# EAGLE design frontend (EAGLE 9.1.1)

## Sheet 1 of 4
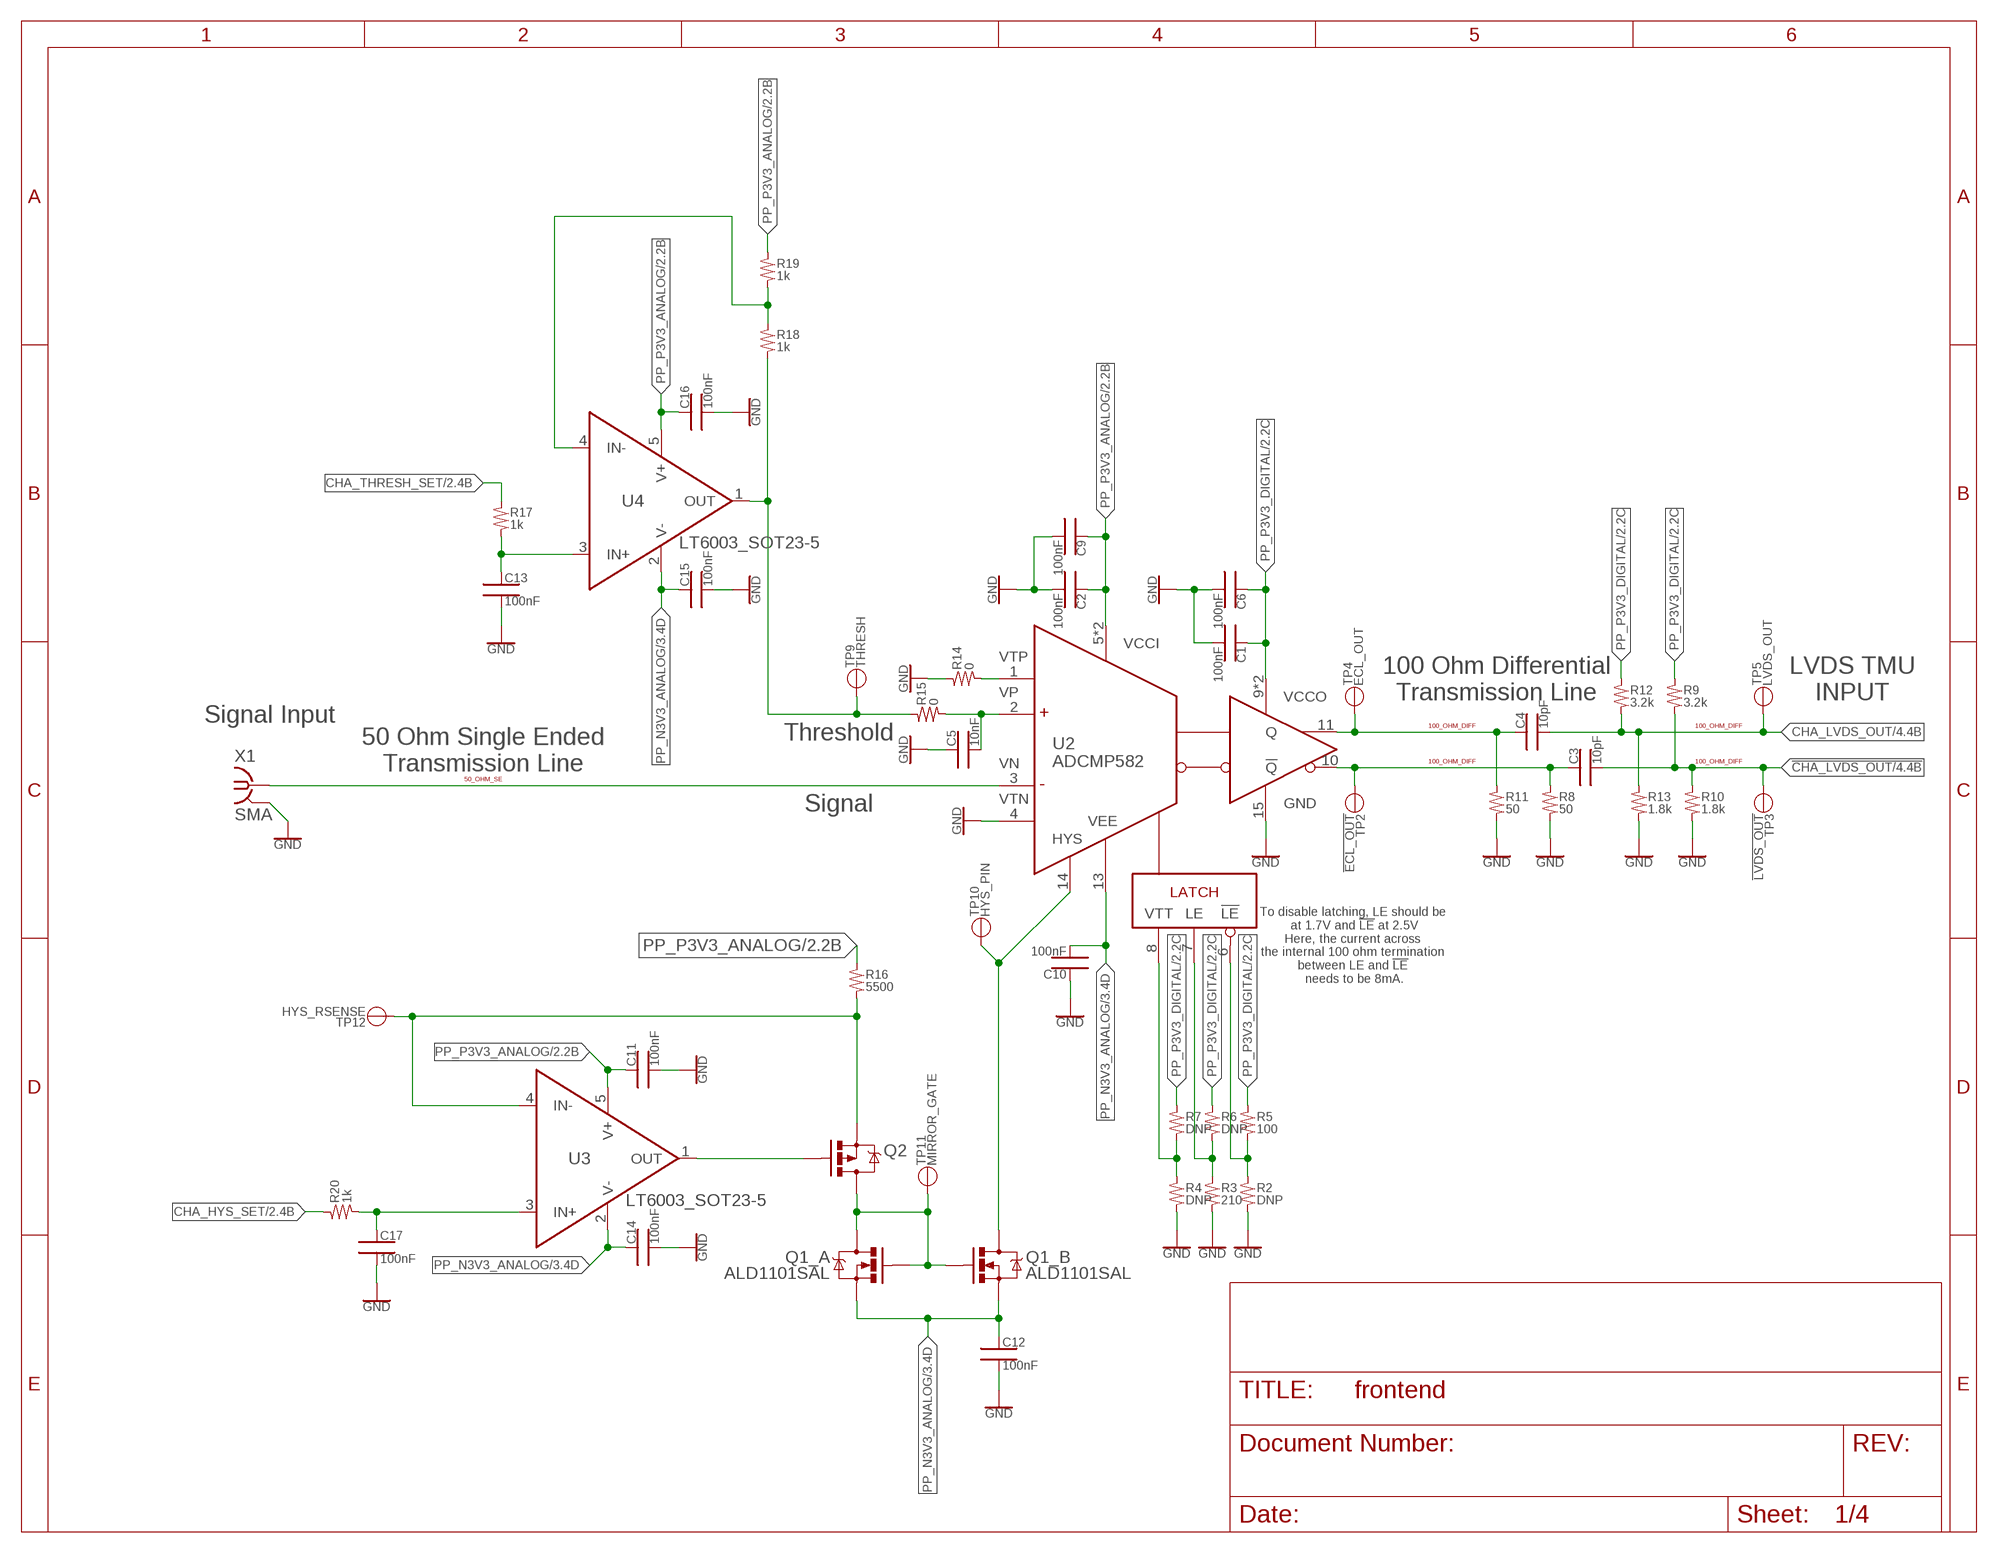
[diagram p0: schematic, sheet 1]

### Parts
C1  100nF  CAP_0402  [0402]
C2  100nF  CAP_0402  [0402]
C3  10pF  CAP_0402  [0402]
C4  10pF  CAP_0402  [0402]
C5  10nF  CAP_0402  [0402]
C6  100nF  CAP_0402  [0402]
C9  100nF  CAP_0402  [0402]
C10  100nF  CAP_0402  [0402]
C11  100nF  CAP_0402  [0402]
C12  100nF  CAP_0402  [0402]
C13  100nF  CAP_0402  [0402]
C14  100nF  CAP_0402  [0402]
C15  100nF  CAP_0402  [0402]
C16  100nF  CAP_0402  [0402]
C17  100nF  CAP_0402  [0402]
Q1  ALD1101SAL  [SOIC_8]
Q2  MOSFET_P-CHANNEL_SOT23-3  [SOT23-3]
R2  DNP  RES_0402  [0402]
R3  210  RES_0402  [0402]
R4  DNP  RES_0402  [0402]
R5  100  RES_0402  [0402]
R6  DNP  RES_0402  [0402]
R7  DNP  RES_0402  [0402]
R8  50  RES_0402  [0402]
R9  3.2k  RES_0402  [0402]
R10  1.8k  RES_0402  [0402]
R11  50  RES_0402  [0402]
R12  3.2k  RES_0402  [0402]
R13  1.8k  RES_0402  [0402]
R14  0  RES_0402  [0402]
R15  0  RES_0402  [0402]
R16  5500  RES_0402  [0402]
R17  1k  RES_0402  [0402]
R18  1k  RES_0402  [0402]
R19  1k  RES_0402  [0402]
R20  1k  RES_0402  [0402]
TP2  !ECL_OUT  TESTPOINT_PAD  [TESTPOINT_PAD]
TP3  !LVDS_OUT  TESTPOINT_PAD  [TESTPOINT_PAD]
TP4  ECL_OUT  TESTPOINT_PAD  [TESTPOINT_PAD]
TP5  LVDS_OUT  TESTPOINT_PAD  [TESTPOINT_PAD]
TP9  THRESH  TESTPOINT_A  [1X01]
TP10  HYS_PIN  TESTPOINT_A  [1X01]
TP11  MIRROR_GATE  TESTPOINT_A  [1X01]
TP12  HYS_RSENSE  TESTPOINT_A  [1X01]
U2  ADCMP582  [QFN50P300X300X80-16N]
U3  LT6003_SOT23-5  [SOT23-5]
U4  LT6003_SOT23-5  [SOT23-5]
X1  SMA  [J502-ND-142-0701-881/886]

### Nets
!CHA_LVDS_OUT [100_OHM_DIFF]: C3.2 R9.2 R10.1 TP3.TP ; also sheet 4
CHA_HYS_SET: R20.1 ; also sheet 2
CHA_LVDS_OUT [100_OHM_DIFF]: C4.2 R12.2 R13.1 TP5.TP ; also sheet 4
CHA_THRESH_SET: R17.1 ; also sheet 2
GND: C1.2 C2.2 C5.1 C6.2 C9.2 C10.1 C11.2 C12.2 C13.2 C14.2 C15.2 C16.2 C17.2 R2.2 R3.2 R4.2 R8.2 R10.2 R11.2 R13.2 R14.1 U2.4(VTN) U2.15(GND) X1.G@1(GND) X1.G@2(GND) X1.G@3(GND) X1.G@4(GND) ; also sheet 2,3,4
N$1: Q2.2(S) R16.2 TP12.1(TP) U3.4(IN-)
N$2: Q1.2(_A:G) Q1.3(_A:D) Q1.6(_B:G) Q2.3(D) TP11.1(TP)
N$3 [100_OHM_DIFF]: C3.1 R8.1 TP2.TP U2.10(!Q)
N$6 [100_OHM_DIFF]: C4.1 R11.1 TP4.TP U2.11(Q)
N$7: R14.2 U2.1(VTP)
N$9: C13.1 R17.2 U4.3(IN+)
N$10: Q2.1(G) U3.1(OUT)
N$12: R18.1 R19.2 U4.4(IN-)
N$13: R15.1 R18.2 TP9.1(TP) U4.1(OUT)
N$17: C17.1 R20.2 U3.3(IN+)
N$18 [50_OHM_SE]: U2.3(VN) X1.1
N$37: C5.2 R15.2 U2.2(VP)
N$38: R4.1 R7.2 U2.8(VTT)
N$39: R3.1 R6.2 U2.7(LE)
N$41: R2.1 R5.2 U2.6(!LE)
N$42: Q1.5(_B:D) TP10.1(TP) U2.14(HYS)
PP_N3V3_ANALOG: C10.2 C12.1 C14.1 C15.1 Q1.1(_A:S) Q1.7(_B:S) Q1.8(_A:S) U2.13(VEE) U3.2(V-) U4.2(V-) ; also sheet 3
PP_P3V3_ANALOG: C2.1 C9.1 C11.1 C16.1 R16.1 R19.1 U2.5(VCCI) U2.16(VCCI) U3.5(V+) U4.5(V+) ; also sheet 2,3
PP_P3V3_DIGITAL: C1.1 C6.1 R5.1 R6.1 R7.1 R9.1 R12.1 U2.9(VCCO) U2.12(VCCO) ; also sheet 2,3,4

### Notes on the sheet
- 100 Ohm Differential
  Transmission Line
- LVDS TMU
  INPUT
- Signal Input
- 100_OHM_DIFF | 100_OHM_DIFF
- Threshold
- 50 Ohm Single Ended
  Transmission Line
- 100_OHM_DIFF | 100_OHM_DIFF
- 50_OHM_SE
- Signal
- To disable latching, LE should be 
  at 1.7V and !LE! at 2.5V
  Here, the current across 
  the internal 100 ohm termination 
  between LE and !LE! 
  needs to be 8mA.

## Sheet 2 of 4
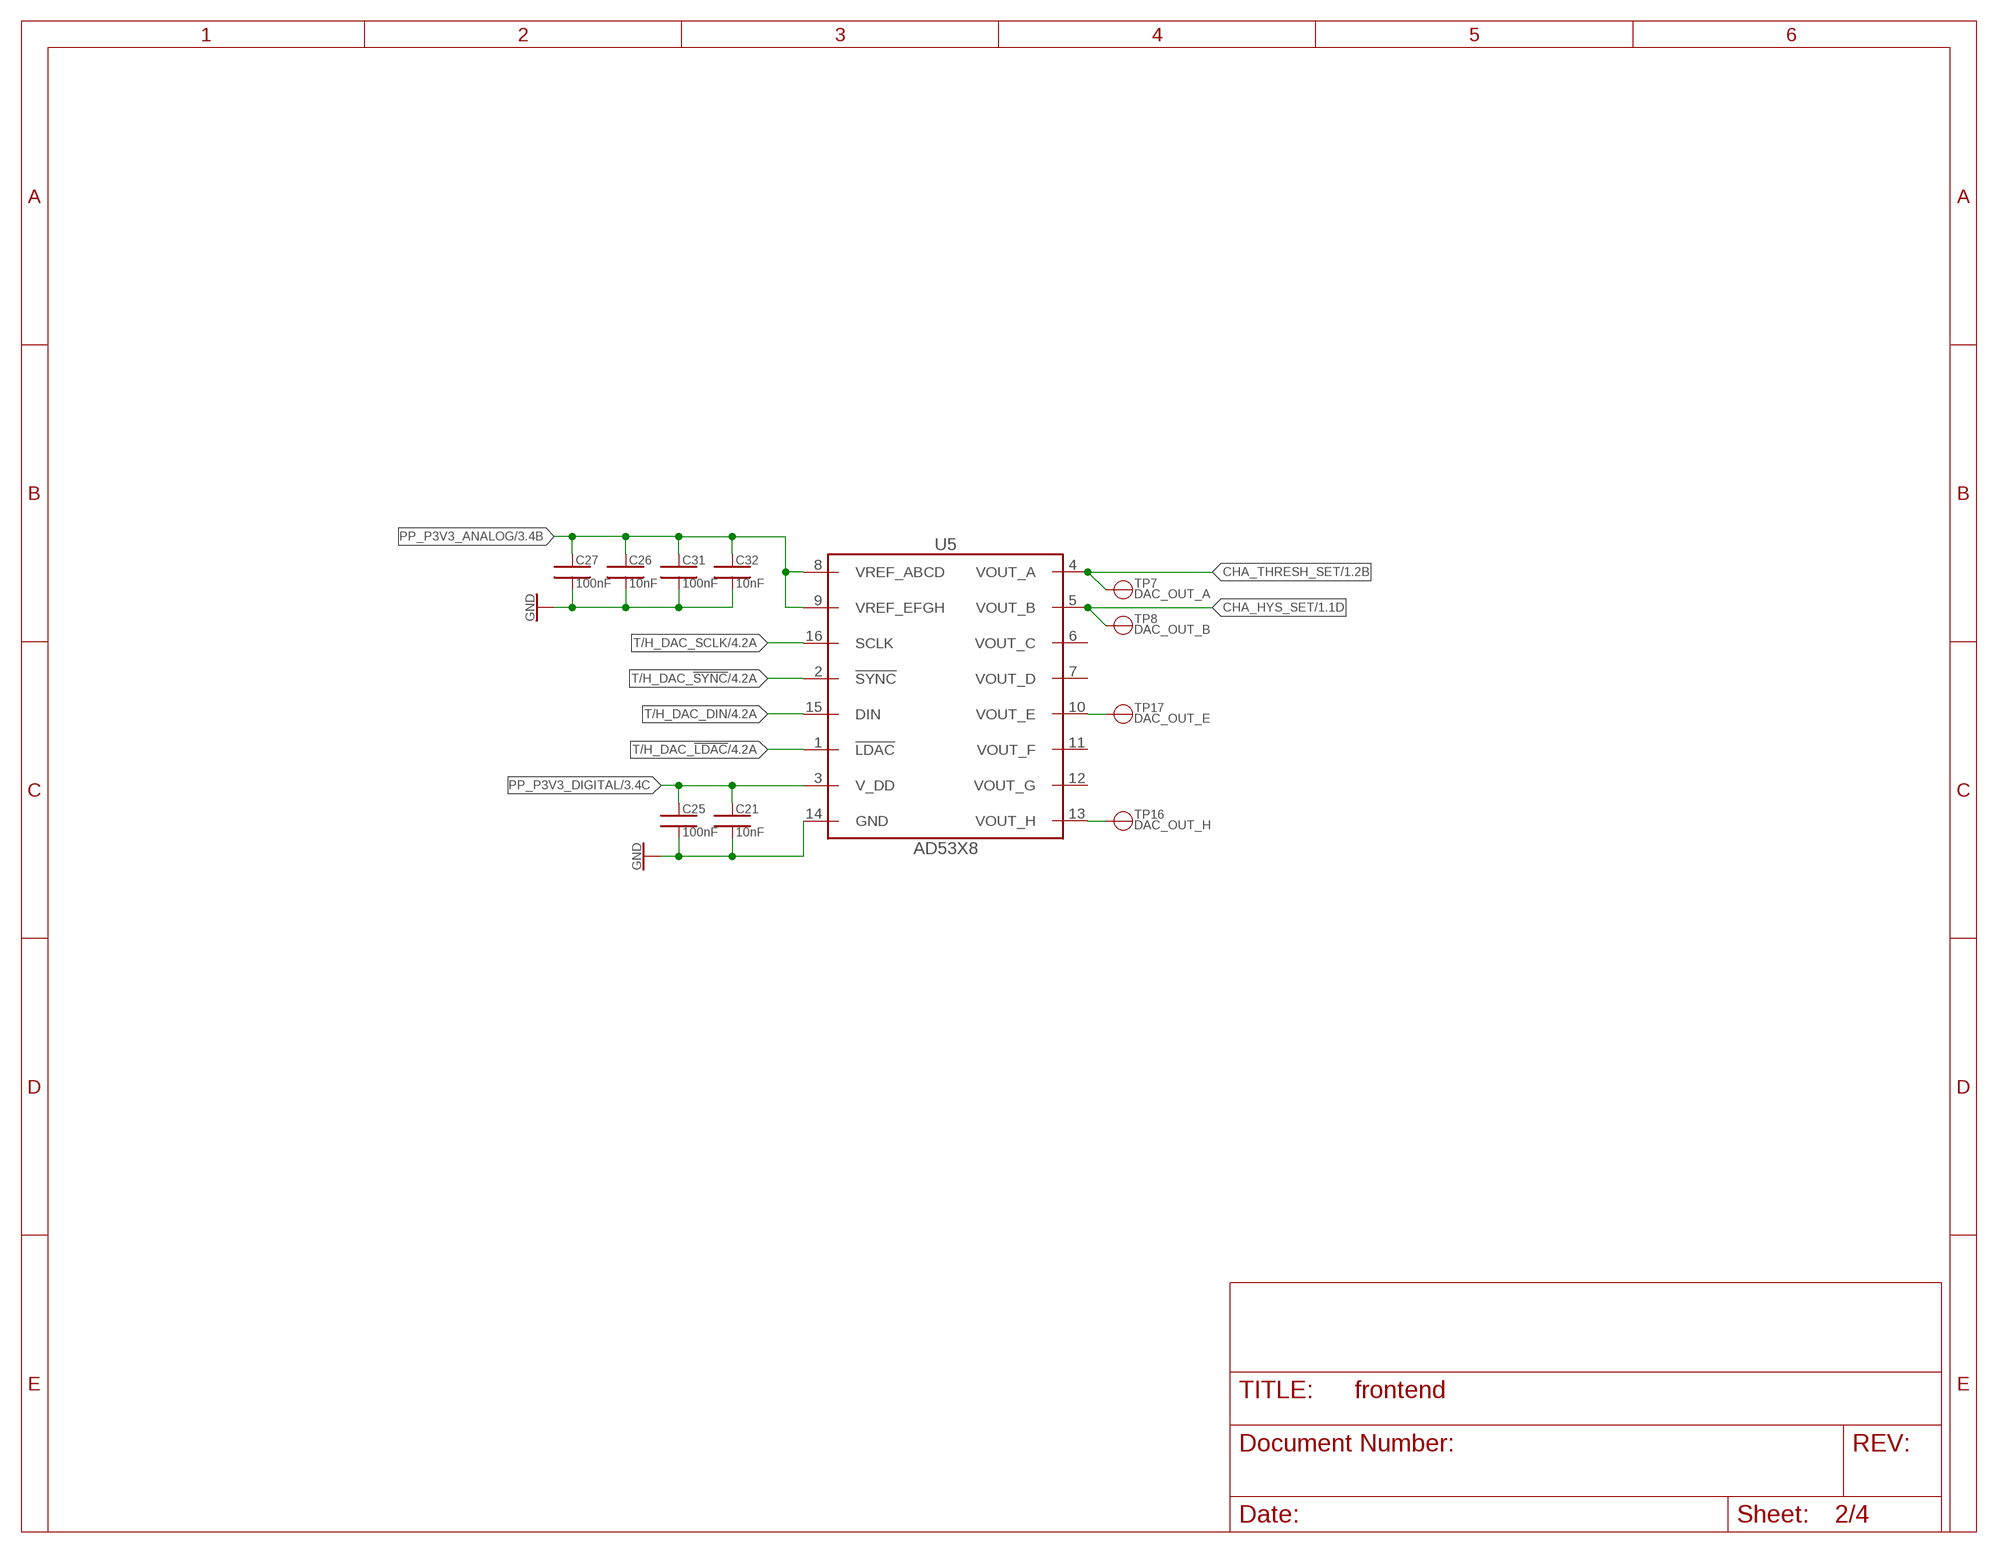
[diagram p1: schematic, sheet 2]

### Parts
C21  10nF  CAP_0402  [0402]
C25  100nF  CAP_0402  [0402]
C26  10nF  CAP_0402  [0402]
C27  100nF  CAP_0402  [0402]
C31  100nF  CAP_0402  [0402]
C32  10nF  CAP_0402  [0402]
TP7  DAC_OUT_A  TESTPOINT_A  [1X01]
TP8  DAC_OUT_B  TESTPOINT_A  [1X01]
TP16  DAC_OUT_H  TESTPOINT_A  [1X01]
TP17  DAC_OUT_E  TESTPOINT_A  [1X01]
U5  AD53X8  [TSSOP-16]

### Nets
CHA_HYS_SET: TP8.1(TP) U5.5(VOUT_B) ; also sheet 1
CHA_THRESH_SET: TP7.1(TP) U5.4(VOUT_A) ; also sheet 1
GND: C21.2 C25.2 C26.2 C27.2 C31.2 C32.2 U5.14(GND) ; also sheet 1,3,4
N$8: TP17.1(TP) U5.10(VOUT_E)
N$11: TP16.1(TP) U5.13(VOUT_H)
PP_P3V3_ANALOG: C26.1 C27.1 C31.1 C32.1 U5.8(VREF_ABCD) U5.9(VREF_EFGH) ; also sheet 1,3
PP_P3V3_DIGITAL: C21.1 C25.1 U5.3(V_DD) ; also sheet 1,3,4
T/H_DAC_!LDAC!: U5.1(!LDAC) ; also sheet 4
T/H_DAC_!SYNC!: U5.2(!SYNC) ; also sheet 4
T/H_DAC_DIN: U5.15(DIN) ; also sheet 4
T/H_DAC_SCLK: U5.16(SCLK) ; also sheet 4
Unconnected: U5.6(VOUT_C) U5.7(VOUT_D) U5.11(VOUT_F) U5.12(VOUT_G)

## Sheet 3 of 4
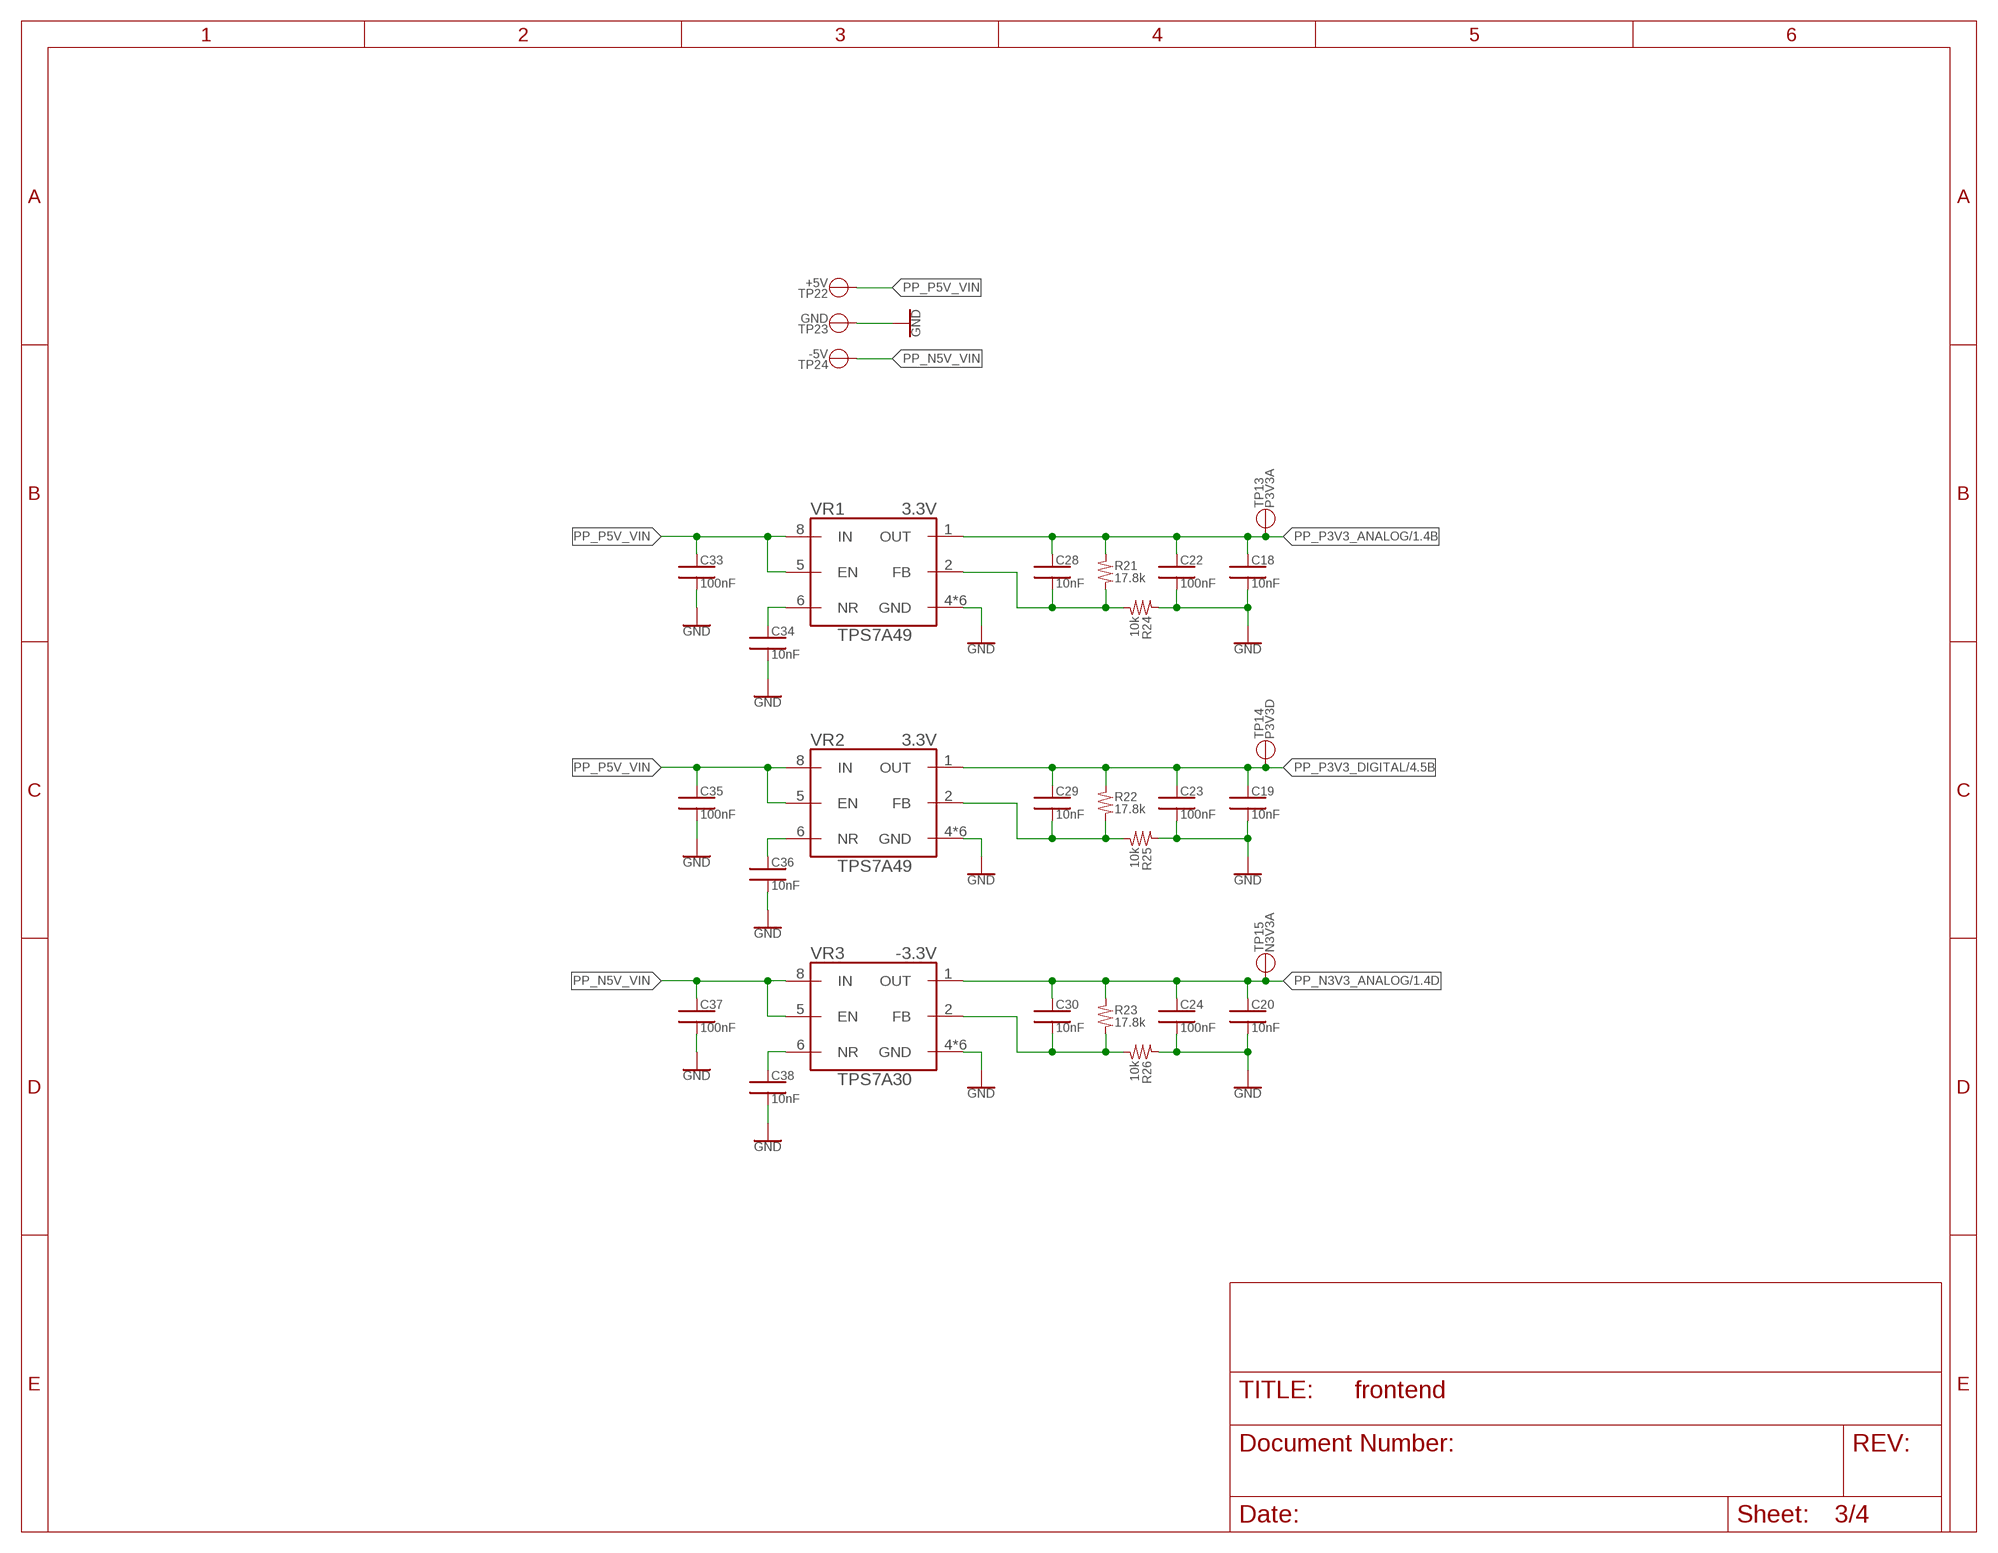
[diagram p2: schematic, sheet 3]

### Parts
C18  10nF  CAP_0402  [0402]
C19  10nF  CAP_0402  [0402]
C20  10nF  CAP_0402  [0402]
C22  100nF  CAP_0402  [0402]
C23  100nF  CAP_0402  [0402]
C24  100nF  CAP_0402  [0402]
C28  10nF  CAP_0402  [0402]
C29  10nF  CAP_0402  [0402]
C30  10nF  CAP_0402  [0402]
C33  100nF  CAP_0402  [0402]
C34  10nF  CAP_0402  [0402]
C35  100nF  CAP_0402  [0402]
C36  10nF  CAP_0402  [0402]
C37  100nF  CAP_0402  [0402]
C38  10nF  CAP_0402  [0402]
R21  17.8k  RES_0402  [0402]
R22  17.8k  RES_0402  [0402]
R23  17.8k  RES_0402  [0402]
R24  10k  RES_0402  [0402]
R25  10k  RES_0402  [0402]
R26  10k  RES_0402  [0402]
TP13  P3V3A  TESTPOINT_A  [1X01]
TP14  P3V3D  TESTPOINT_A  [1X01]
TP15  N3V3A  TESTPOINT_A  [1X01]
TP22  +5V  TESTPOINT_A  [1X01]
TP23  GND  TESTPOINT_A  [1X01]
TP24  -5V  TESTPOINT_A  [1X01]
VR1  3.3V  TPS7A49  [VSON]
VR2  3.3V  TPS7A49  [VSON]
VR3  -3.3V  TPS7A30  [VSON]

### Nets
GND: C18.2 C19.2 C20.2 C22.2 C23.2 C24.2 C33.2 C34.2 C35.2 C36.2 C37.2 C38.2 R24.1 R25.1 R26.1 TP23.1(TP) VR1.4(GND) VR1.TP(GND) VR1.TP_A(GND) VR1.TP_B(GND) VR1.TP_C(GND) VR1.TP_D(GND) VR2.4(GND) VR2.TP(GND) VR2.TP_A(GND) VR2.TP_B(GND) VR2.TP_C(GND) VR2.TP_D(GND) VR3.4(GND) VR3.TP(GND) VR3.TP_A(GND) VR3.TP_B(GND) VR3.TP_C(GND) VR3.TP_D(GND) ; also sheet 1,2,4
N$4: C30.2 R23.2 R26.2 VR3.2(FB)
N$5: C28.2 R21.2 R24.2 VR1.2(FB)
N$16: C36.1 VR2.6(NR)
N$19: C34.1 VR1.6(NR)
N$21: C29.2 R22.2 R25.2 VR2.2(FB)
N$25: C38.1 VR3.6(NR)
PP_N3V3_ANALOG: C20.1 C24.1 C30.1 R23.1 TP15.1(TP) VR3.1(OUT) ; also sheet 1
PP_N5V_VIN: C37.1 TP24.1(TP) VR3.5(EN) VR3.8(IN)
PP_P3V3_ANALOG: C18.1 C22.1 C28.1 R21.1 TP13.1(TP) VR1.1(OUT) ; also sheet 1,2
PP_P3V3_DIGITAL: C19.1 C23.1 C29.1 R22.1 TP14.1(TP) VR2.1(OUT) ; also sheet 1,2,4
PP_P5V_VIN: C33.1 C35.1 TP22.1(TP) VR1.5(EN) VR1.8(IN) VR2.5(EN) VR2.8(IN)

## Sheet 4 of 4
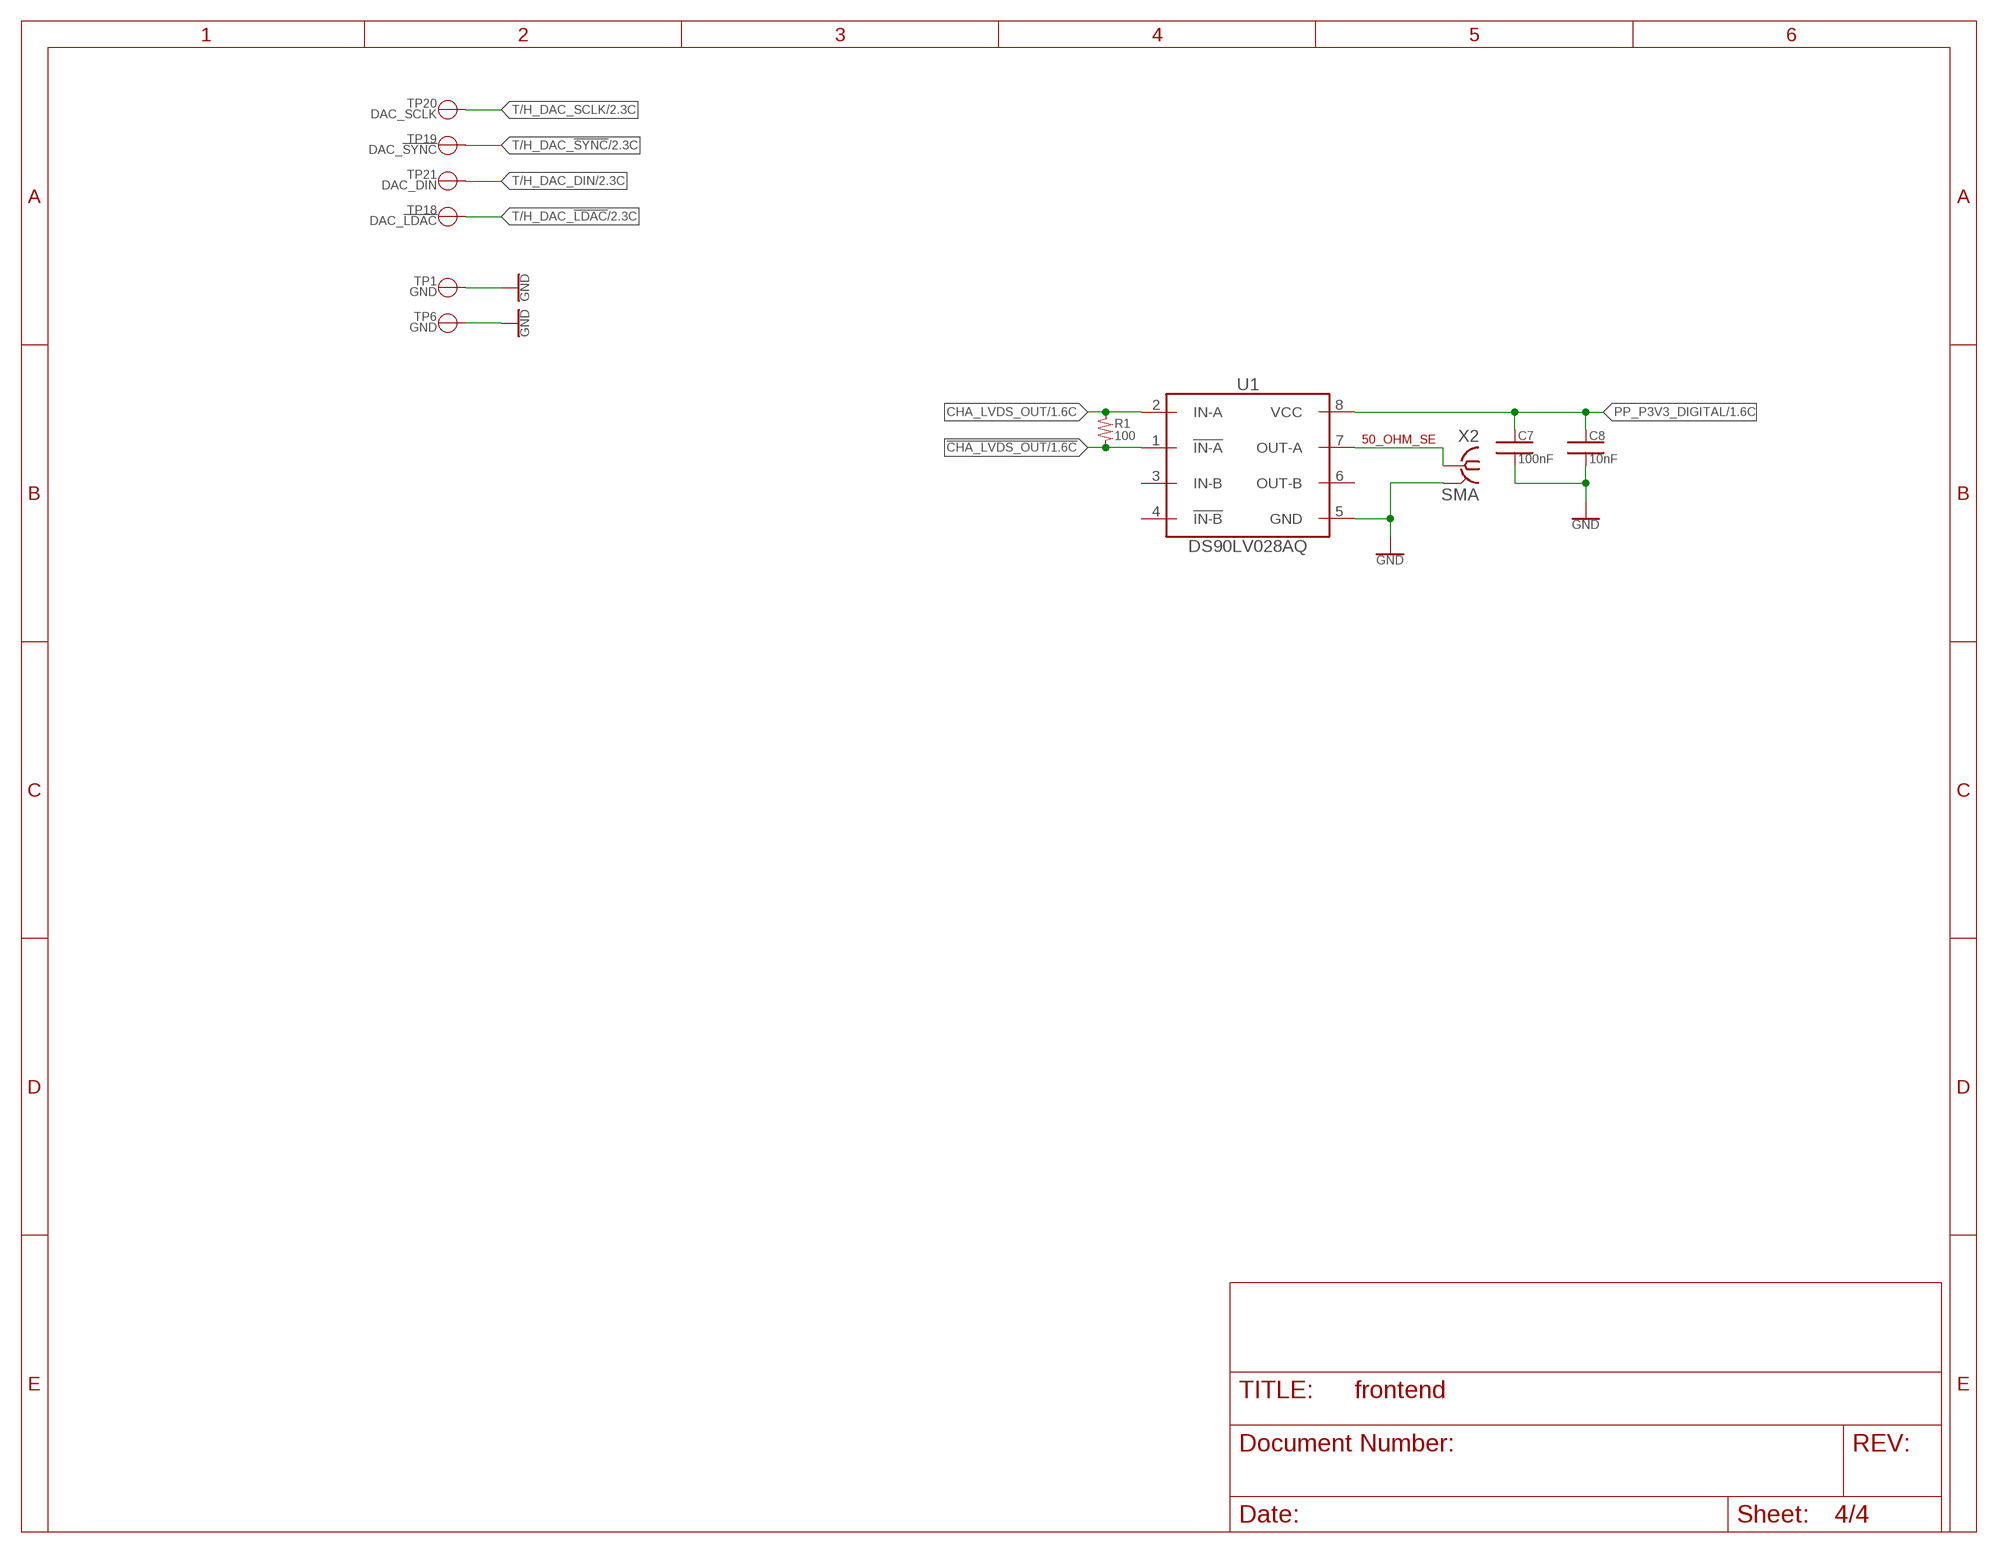
[diagram p3: schematic, sheet 4]

### Parts
C7  100nF  CAP_0402  [0402]
C8  10nF  CAP_0402  [0402]
R1  100  RES_0402  [0402]
TP1  GND  TESTPOINT_A  [1X01]
TP6  GND  TESTPOINT_A  [1X01]
TP18  DAC_!LDAC!  TESTPOINT_A  [1X01]
TP19  DAC_!SYNC!  TESTPOINT_A  [1X01]
TP20  DAC_SCLK  TESTPOINT_A  [1X01]
TP21  DAC_DIN  TESTPOINT_A  [1X01]
U1  DS90LV028AQ  [SOIC_8]
X2  SMA  [J502-ND-142-0701-881/886]

### Nets
!CHA_LVDS_OUT [100_OHM_DIFF]: R1.2 U1.1(!IN-A) ; also sheet 1
CHA_LVDS_OUT [100_OHM_DIFF]: R1.1 U1.2(IN-A) ; also sheet 1
GND: C7.2 C8.2 TP1.1(TP) TP6.1(TP) U1.5(GND) X2.G@1(GND) X2.G@2(GND) X2.G@3(GND) X2.G@4(GND) ; also sheet 1,2,3
N$22 [50_OHM_SE]: U1.7(OUT-A) X2.1
PP_P3V3_DIGITAL: C7.1 C8.1 U1.8(VCC) ; also sheet 1,2,3
T/H_DAC_!LDAC!: TP18.1(TP) ; also sheet 2
T/H_DAC_!SYNC!: TP19.1(TP) ; also sheet 2
T/H_DAC_DIN: TP21.1(TP) ; also sheet 2
T/H_DAC_SCLK: TP20.1(TP) ; also sheet 2
Unconnected: U1.3(IN-B) U1.4(!IN-B) U1.6(OUT-B)

### Notes on the sheet
- 50_OHM_SE

## Library data of the parts
C1-C38 = tcspc_lib:CAP
Q1 = tcspc_lib:ALD1101SAL: Dual Matched N channel mosfets, warning, the sources are already connected to eacother via the substrate
Q2 = tcspc_lib:MOSFET_P-CHANNEL
R1-R26 = tcspc_lib:RES
TP1-TP24 = tcspc_lib:TESTPOINT: A simple test point with multiple ways to tap off a signal
U1 = tcspc_lib:DS90LV028AQ: LVDS Dual Differential Line Receiver http://www.ti.com/lit/ds/symlink/ds90lv028aq-q1.pdf
U2 = tcspc_lib:ADCMP582: Ultrafast SiGe Voltage Comparator w/. PECL Outputs http://www.analog.com/media/en/technical-documentation/data-sheets/ADCMP580_581_582.pdf
U3 U4 = tcspc_lib:LT6003: OpAmp RrR 1.6v-16v Precision
U5 = tcspc_lib:AD53X8: 8/10/12 bit, 2.5v to 5.5v, 8 channel DAC
VR1 VR2 = tcspc_lib:TPS7A49: 36v 150mA ultralow noise positive linear regulator http://www.ti.com/lit/ds/symlink/tps7a49.pdf
VR3 = tcspc_lib:TPS7A30: -35V -200mA ultralow noise negative linear regulator
X1 X2 = tcspc_lib:SMA

## Net classes
1 50_OHM_SE: width 0.203 mm
2 100_OHM_DIFF: width 0.152 mm, clearance 0.29 mm

## Board
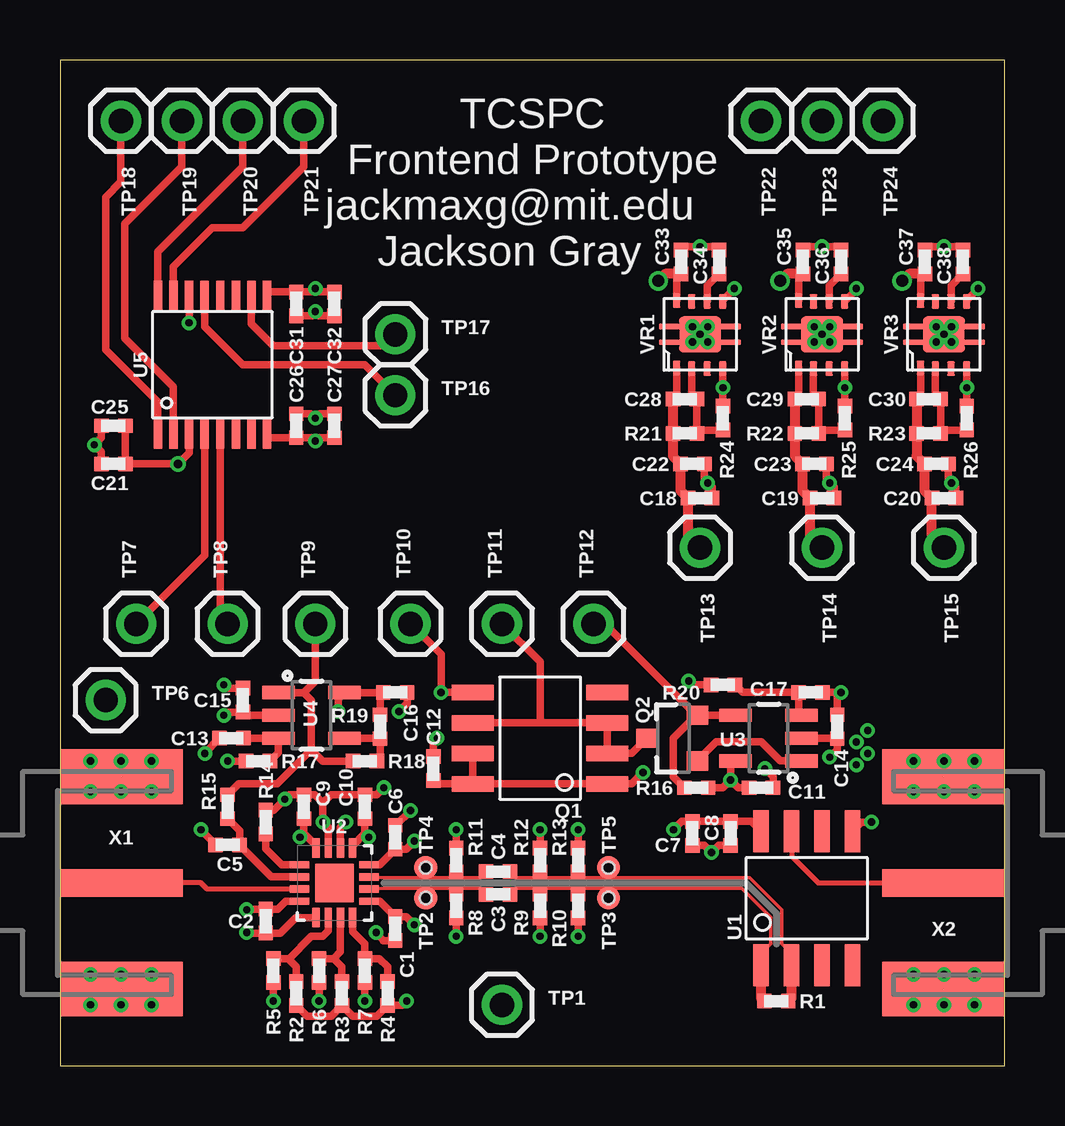
[diagram p4: board, top side]
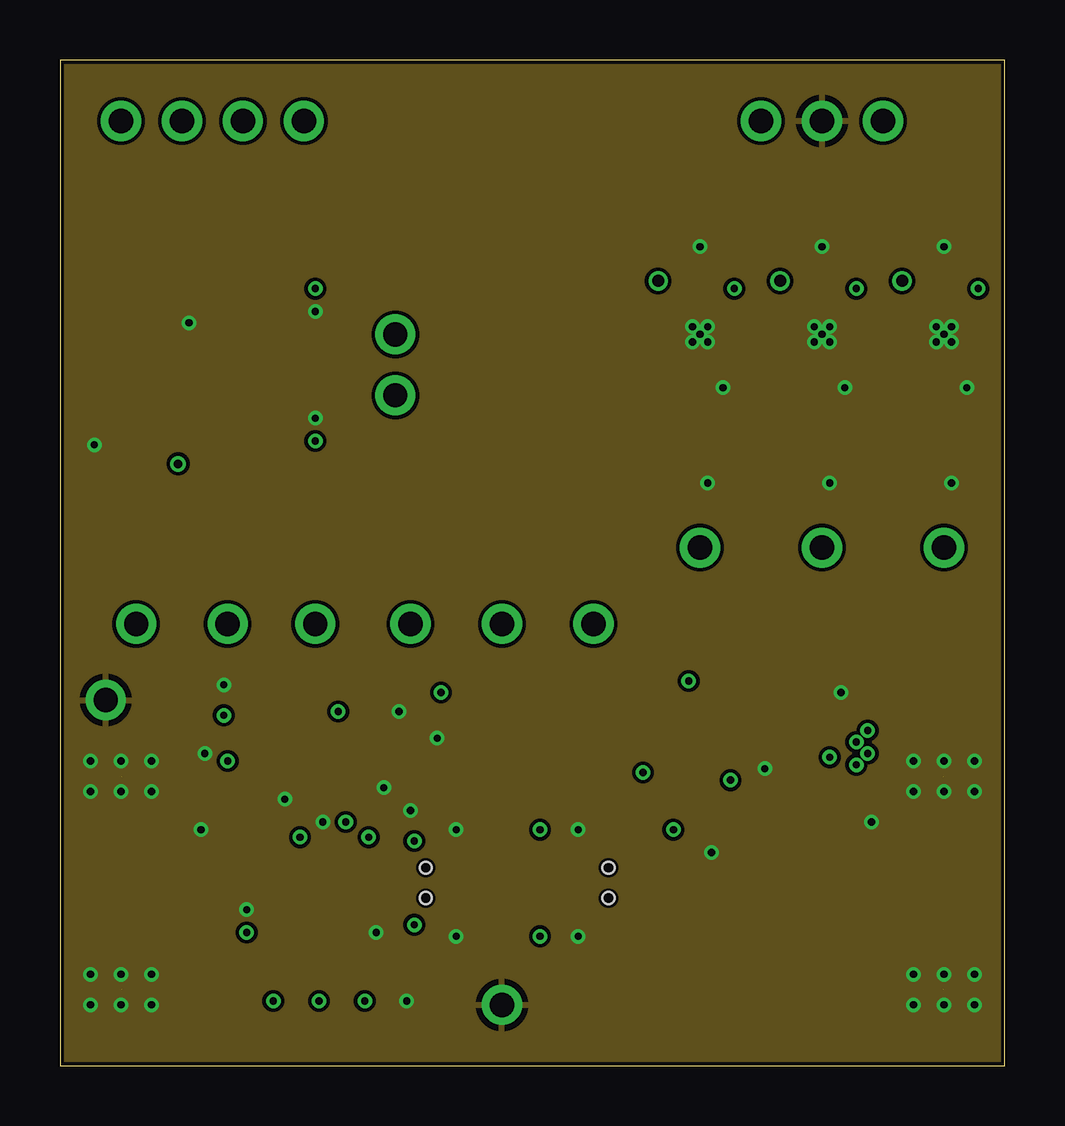
[diagram p5: board, inner layer Route2]
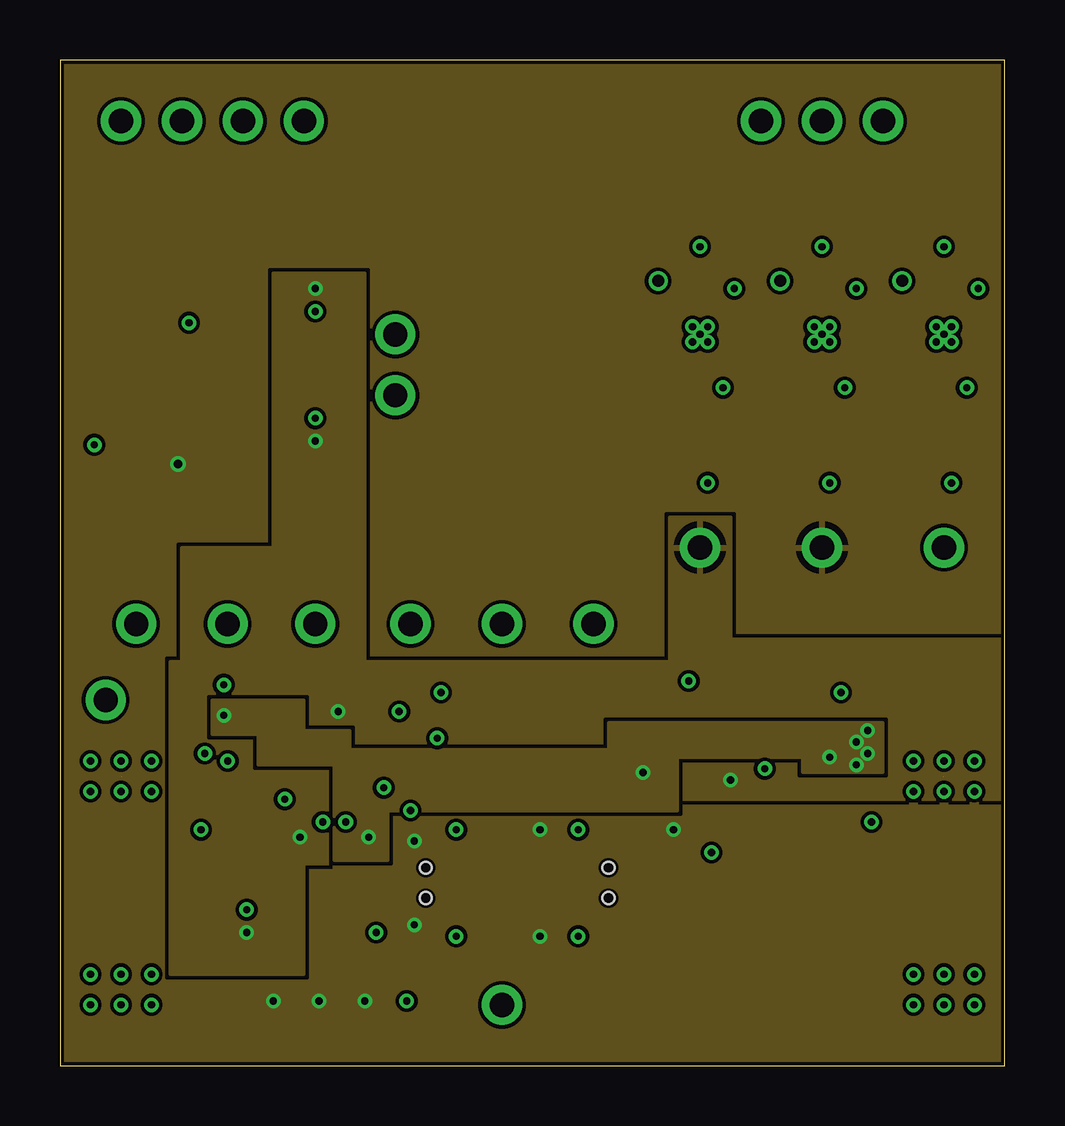
[diagram p6: board, inner layer Route15]
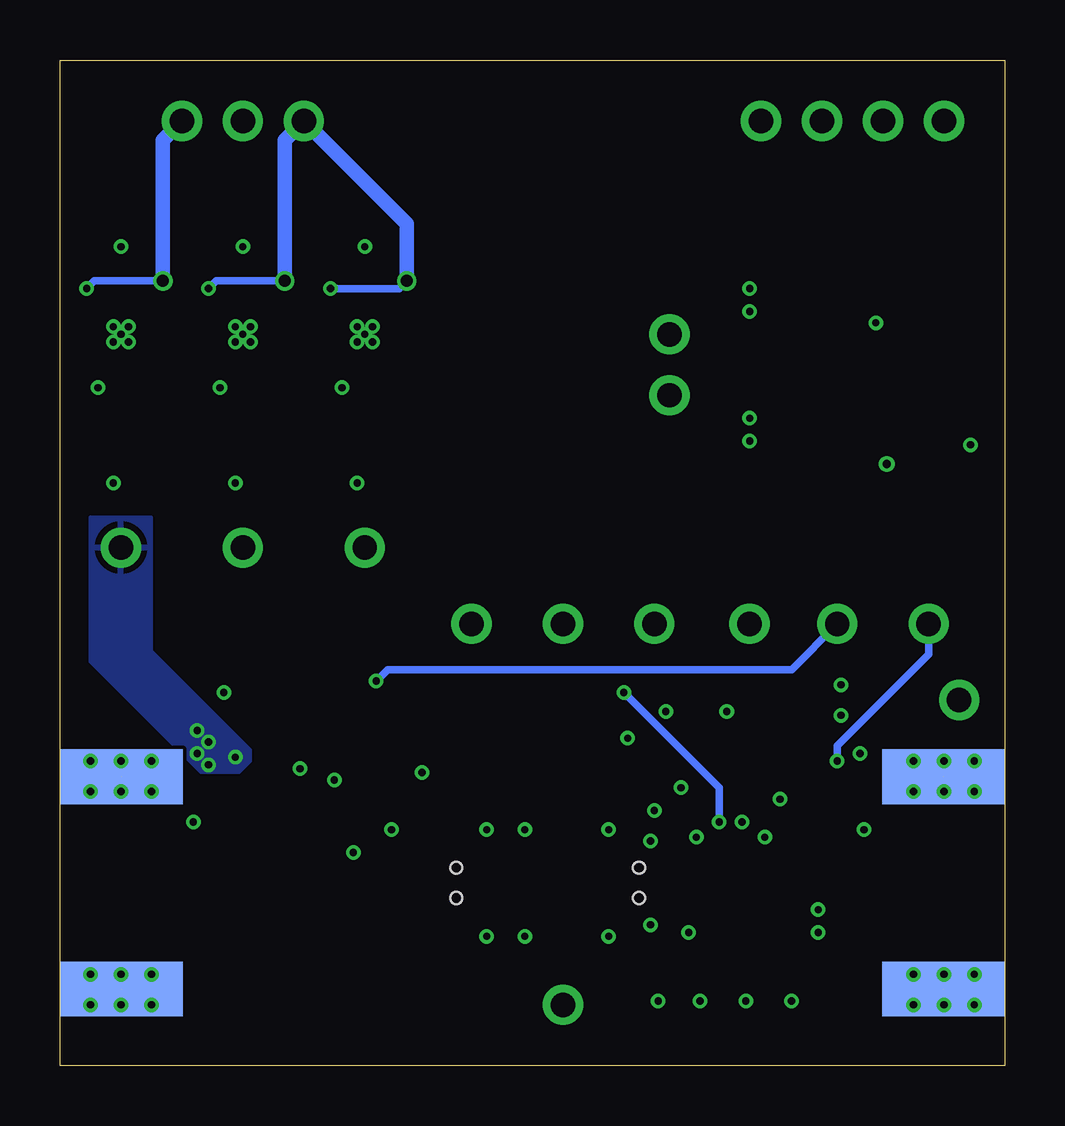
[diagram p7: board, bottom side, seen from below]

Size 39.37 x 41.91 mm. Coordinates in mm from the lower left corner, seen from the top.
Outline: 0,0 39.37,0 39.37,41.91 0,41.91 0,0
Copper layers (1+2*15+16): Top 0.035mm / dielectric 1.5mm / Route2 0.035mm / dielectric 0.15mm / Route15 0.035mm / dielectric 0.2mm / Bottom 0.035mm
Design rules "3PCB_4layer": minimum track width 6mil, minimum drill 0.2mm, track to track 6mil, track to pad 6mil, pad to pad 6mil, via to via 6mil, smd to smd 0mil, copper to edge 6mil, drill to drill 6mil, minimum pad ring 6mil, minimum via ring 6mil, stop-mask expansion 2mil, vias tented up to drill 0.3mm, thermal gap 10mil

### Footprints (pad centres in the part's own frame; a part is rotated, then mirrored left to right if it is on the bottom)
0402 = smd 0.6 x 0.6: 1 -0.5,0; 2 0.5,0
SOIC_8 = smd 1.75 x 0.65: 1 -2.8,1.905; 2 -2.8,0.635; 3 -2.8,-0.635; 4 -2.8,-1.905; 5 2.8,-1.905; 6 2.8,-0.635; 7 2.8,0.635; 8 2.8,1.905
SOT23-3 = smd 0.8 x 0.9: 1 -0.95,-1; 2 0.95,-1; 3 0,1.1
1X01 = drill 1.016 pad 1.676: 1 0,0
TESTPOINT_PAD = smd 0.953 x 0.953: TP 0,0 | hole 0.5: 0,0
QFN50P300X300X80-16N = smd 0.813 x 0.305: 1 -1.448,0.762; 2 -1.448,0.254; 3 -1.448,-0.254; 4 -1.448,-0.762; 9 1.448,-0.762; 10 1.448,-0.254; 11 1.448,0.254; 12 1.448,0.762 | smd 0.305 x 0.813: 5 -0.762,-1.448; 6 -0.254,-1.448; 7 0.254,-1.448; 8 0.762,-1.448; 13 0.762,1.448; 14 0.254,1.448; 15 -0.254,1.448; 16 -0.762,1.448 | smd 1.6 x 1.6: 17 0,0
SOT23-5 = smd 0.55 x 1.35: 1 -0.95,-1.375; 2 0,-1.375; 3 0.95,-1.375; 4 0.95,1.375; 5 -0.95,1.375
TSSOP-16 = smd 1.2 x 0.35: 1 -2.9,2.275; 2 -2.9,1.625; 3 -2.9,0.975; 4 -2.9,0.325; 5 -2.9,-0.325; 6 -2.9,-0.975; 7 -2.9,-1.625; 8 -2.9,-2.275; 9 2.9,-2.275; 10 2.9,-1.625; 11 2.9,-0.975; 12 2.9,-0.325; 13 2.9,0.325; 14 2.9,0.975; 15 2.9,1.625; 16 2.9,2.275
VSON = smd 0.6 x 0.31: 1 -1.4,0.975; 2 -1.43,0.355; 3 -1.43,-0.295; 4 -1.43,-0.945; 5 1.37,-0.945; 6 1.37,-0.295; 7 1.37,0.355; 8 1.4,0.975 | smd 1.5 x 1.75: TP 0,0 | smd 0.23 x 1.025: TP_A -0.325,1.188; TP_B -0.325,-1.188; TP_C 0.325,-1.188; TP_D 0.325,1.188
J502-ND-142-0701-881/886 = smd 5.08 x 1.143: 1 2.565,0 | smd 5.08 x 2.286: G@1 2.565,4.42; G@2 2.565,-4.42 | smd 5.08 x 2.286 bottom: G@3 2.565,4.42; G@4 2.565,-4.42

### Placement (x,y rotation side)
C1  13.97,5.71 270 top
C2  8.57,6.03 90 top
C3  18.26,7.14 0 top
C4  18.26,8.1 0 top
C5  6.99,9.21 0 top
C6  13.97,9.53 90 top
C7  26.35,9.68 270 top
C8  27.94,9.68 270 top
C9  10.16,10.79 90 top
C10  12.7,10.79 270 top
C11  29.21,11.59 0 top
C12  15.56,12.38 90 top
C13  7.14,13.65 180 top
C14  32.38,14.13 90 top
C15  7.62,15.24 90 top
C16  13.97,15.56 0 top
C17  31.27,15.56 0 top
C18  26.67,23.65 0 top
C19  31.75,23.65 0 top
C20  36.83,23.65 0 top
C21  2.22,25.08 180 top
C22  26.35,25.08 0 top
C23  31.43,25.08 0 top
C24  36.51,25.08 0 top
C25  2.22,26.67 180 top
C26  9.84,26.67 90 top
C27  11.43,26.67 90 top
C28  26.04,27.78 0 top
C29  31.11,27.78 0 top
C30  36.2,27.78 0 top
C31  9.84,31.75 270 top
C32  11.43,31.75 270 top
C33  25.88,33.5 90 top
C34  27.46,33.5 90 top
C35  30.96,33.5 90 top
C36  32.54,33.5 90 top
C37  36.04,33.5 90 top
C38  37.62,33.5 90 top
Q1  20,13.65 180 top
Q2  25.56,13.65 90 top
R1  29.84,2.7 180 top
R2  9.84,3.02 270 top
R3  11.75,3.02 270 top
R4  13.65,3.02 270 top
R5  8.89,3.97 90 top
R6  10.79,3.97 90 top
R7  12.7,3.97 90 top
R8  16.51,6.67 270 top
R9  20,6.67 90 top
R10  21.59,6.67 270 top
R11  16.51,8.57 90 top
R12  20,8.57 270 top
R13  21.59,8.57 90 top
R14  8.57,10.16 270 top
R15  6.99,10.79 270 top
R16  26.51,11.59 180 top
R17  8.26,12.7 0 top
R18  12.7,12.7 180 top
R19  13.34,14.13 270 top
R20  27.62,15.88 0 top
R21  26.04,26.35 0 top
R22  31.11,26.35 0 top
R23  36.2,26.35 0 top
R24  27.62,26.99 270 top
R25  32.7,26.99 270 top
R26  37.78,26.99 270 top
TP1  18.41,2.54 0 top
TP2  15.24,6.99 270 top
TP3  22.86,6.99 270 top
TP4  15.24,8.26 90 top
TP5  22.86,8.26 90 top
TP6  1.91,15.24 0 top
TP7  3.17,18.41 90 top
TP8  6.99,18.41 90 top
TP9  10.64,18.41 90 top
TP10  14.61,18.41 90 top
TP11  18.41,18.41 90 top
TP12  22.23,18.41 90 top
TP13  26.67,21.59 270 top
TP14  31.75,21.59 270 top
TP15  36.83,21.59 270 top
TP16  13.97,27.94 0 top
TP17  13.97,30.48 0 top
TP18  2.54,39.37 270 top
TP19  5.08,39.37 270 top
TP20  7.62,39.37 270 top
TP21  10.16,39.37 270 top
TP22  29.21,39.37 270 top
TP23  31.75,39.37 270 top
TP24  34.29,39.37 270 top
U1  31.11,6.99 90 top
U2  11.43,7.62 0 top
U3  29.53,13.65 90 top
U4  10.48,14.61 270 top
U5  6.35,29.21 90 top
VR1  26.67,30.48 90 top
VR2  31.75,30.48 90 top
VR3  36.83,30.48 90 top
X1  0,7.62 0 top
X2  39.37,7.62 180 top

### Tracks (layer width: path | path; a pad name or v marks a point on that pad's centre or on a via)
!CHA_LVDS_OUT
  Top 0.152: 22.86,7.4 28.42,7.4 29.62,6.19 29.62,5.08 29.21,4.67 U1.1 | 22.86,7.4 21.59,7.4 | 21.59,7.4 20,7.39 | 20,7.39 19,7.39 C3.2 | R10.1 21.59,7.4 | R9.2 20,7.39 | TP3.TP 22.86,7.4
  Top 0.406: R1.2 29.21,2.83 U1.1
CHA_HYS_SET  (via drill 0.3)
  Top 0.305: U5.5 6.67,18.73 TP8.1 | R20.1 26.35,15.88 v26.19,16.03
  Bottom 0.305: TP8.1 8.89,16.51 25.4,16.51 | 25.72,16.51 25.4,16.51 | 25.4,16.51 25.72,16.51 | 25.72,16.51 v26.19,16.03
CHA_LVDS_OUT
  Top 0.152: 22.86,7.84 28.73,7.84 30.07,6.51 30.07,5.08 30.48,4.67 U1.2 | 22.86,7.84 21.59,7.84 | 21.59,7.84 20,7.84 | 20,7.84 18.99,7.84 C4.2 | R13.1 21.59,7.84 | R12.2 20,7.84 | TP5.TP 22.86,7.84
  Top 0.406: R1.1 30.48,2.83 U1.2
CHA_THRESH_SET  (via drill 0.3)
  Top 0.305: R17.1 v6.99,12.7 | U5.4 6.03,21.27 TP7.1
  Bottom 0.305: TP7.1 3.17,17.14 6.99,13.34 v6.99,12.7
GND  (via drill 0.3)  (4 unrouted)
  Top 0.152: VR1.TP_D v26.34,30.8 VR1.TP | VR1.TP_A v26.34,30.16 VR1.TP | VR1.TP_C v27,30.8 VR1.TP | VR1.TP_B v27,30.16 VR1.TP | VR2.TP_D v31.43,30.8 VR2.TP | VR2.TP_A v31.43,30.16 VR2.TP | VR2.TP_B v32.08,30.16 VR2.TP | VR2.TP_C v32.08,30.8 VR2.TP | VR3.TP_D v36.51,30.8 VR3.TP | VR3.TP_A v36.51,30.16 VR3.TP | VR3.TP_B v37.16,30.16 VR3.TP | VR3.TP_C v37.16,30.8 VR3.TP | X1.G@3 v2.54,11.43 | v36.83,11.43 X2.G@4 v36.83,12.7 | X1.G@4 v2.54,3.81 | X2.G@3 v36.83,3.81
  Top 0.305: U2.4 9.4,6.86 9.07,6.53 C2.2 7.8,6.53 v7.78,6.51 | R8.2 v16.51,5.4 | R11.2 v16.51,9.84 | R13.2 v21.59,9.84 | R10.2 v21.59,5.4 | U2.15 11.18,9.94 v10.95,10.16 10.95,10.95 | 10.95,10.95 10.61,11.29 C9.2 9.55,11.29 v9.37,11.11 8.91,10.66 R14.1 | 10.95,10.95 11.29,11.29 C10.1 13.2,11.29 v13.49,11.59 | C1.2 13.47,5.21 v13.18,5.56 | C5.1 v5.87,9.84 | R24.1 v27.62,28.26 VR1.4 | VR2.4 32.7,28.42 v32.7,28.26 R25.1 | VR3.4 v37.77,28.27 v37.78,28.26 R26.1 | C18.2 27.17,24.11 v26.99,24.29 26.85,24.42 C22.2 | C23.2 31.93,24.42 v32.07,24.29 32.25,24.11 C19.2 | C24.2 37.01,24.42 v37.15,24.29 37.33,24.11 C20.2 | C33.2 26.01,34.13 v26.67,34.13 27.33,34.13 C34.2 | C35.2 31.09,34.13 v31.75,34.13 32.41,34.13 C36.2 | C37.2 36.17,34.13 v36.83,34.13 37.49,34.13 C38.2 | R2.2 10.29,2.06 11.29,2.06 R3.2 12.2,2.06 13.2,2.06 R4.2 14.26,2.52 v14.45,2.7 | C6.2 13.99,10.03 v14.61,10.64 | C15.2 6.96,15.74 v6.83,15.88 | C13.2 v6.03,13.02 | C16.2 14.47,15.11 v14.13,14.76 | C17.2 v32.54,15.56 32.38,15.4 C14.2 | C8.2 27.44,9.18 v27.15,8.89 26.85,9.18 C7.2 | C25.2 1.72,26.17 v1.43,25.88 1.72,25.58 C21.2 | U5.14 v5.38,30.96 | v33.81,10.16 33.4,10.16 U1.5 | C31.2 10.5,31.25 v10.64,31.43 10.77,31.25 C32.2 | C26.2 10.45,27.17 v10.64,26.99 10.82,27.17 C27.2 | C11.2 29.71,12.04 v29.37,12.38 | C12.2 15.56,13.49 v15.72,13.65
  other vias: 1.27,12.7 26.67,30.48 31.75,30.48 36.83,30.48 2.54,12.7 3.81,12.7 3.81,11.43 1.27,11.43 1.27,3.81 3.81,3.81 3.81,2.54 2.54,2.54 1.27,2.54 35.56,12.7 38.1,12.7 38.1,11.43 35.56,11.43 35.56,3.81 38.1,3.81 38.1,2.54 36.83,2.54 35.56,2.54
  pour Route2: -1.27,-1.27 40.64,-1.27 40.64,43.18 -1.27,43.18
N$1
  Top 0.305: U3.4 Q2.2 26.51,14.6 | R16.2 25.56,12.04 25.56,13.65 26.51,14.6 | TP12.1 22.7,18.41 26.51,14.6
N$2
  Top 0.305: Q1.6 20,14.29 | 20,14.29 Q1.3 Q1.2 23.82,13.02 Q2.3 | TP11.1 20,16.83 20,14.29
N$3
  Top 0.152: 15.24,7.4 13.49,7.4 U2.10 | 15.24,7.4 16.51,7.4 | 16.51,7.4 17.52,7.4 C3.1 | TP2.TP 15.24,7.4 | R8.1 16.51,7.4
N$4
  Top 0.305: VR3.2 36.48,28 C30.2 R23.2 36.83,26.49 R26.2
N$5
  Top 0.305: VR1.2 26.32,28 C28.2 R21.2 26.67,26.49 R24.2
N$6
  Top 0.152: 15.24,7.84 13.49,7.84 U2.11 | 15.24,7.84 16.51,7.84 | 16.51,7.84 17.51,7.84 C4.1 | R11.1 16.51,7.84 | TP4.TP 15.24,7.84
N$7
  Top 0.305: U2.1 9.24,8.38 8.57,9.05 R14.2
N$8
  Top 0.305: U5.10 7.97,30.92 8.89,30 13.49,30 TP17.1
N$9
  Top 0.305: C13.1 U4.3 9.1,13.05 R17.2
N$10
  Top 0.305: U3.1 30,12.7 29.21,13.49 27.35,13.49 Q2.1
N$11
  Top 0.305: U5.13 6.03,30.8 7.62,29.21 12.7,29.21 TP16.1
N$12
  Top 0.305: R18.1 13.34,12.84 R19.2 13.31,13.65 U4.4
N$13
  Top 0.305: U4.1 10.16,15.55 | 10.16,15.55 10.48,15.24 10.48,13.18 | 10.48,13.18 10.95,12.7 R18.2 | R15.1 7.44,11.75 8.89,11.75 9.05,11.75 10.48,13.18 | TP9.1 10.64,16.03 10.16,15.55
N$16
  Top 0.305: VR2.6 32.05,32.5 C36.1
N$17
  Top 0.305: U3.3 30.77,14.73 C17.1 28.44,15.56 R20.2
N$18
  Top 0.203: X1.1 5.87,7.62 6.13,7.37 U2.3
N$19
  Top 0.305: VR1.6 26.96,32.5 C34.1
N$21
  Top 0.305: VR2.2 31.39,28 C29.2 R22.2 31.75,26.49 R25.2
N$22
  Top 0.203: U1.7 30.48,8.73 31.59,7.62 X2.1
N$25
  Top 0.305: VR3.6 37.12,32.5 C38.1
N$37
  Top 0.305: U2.2 8.79,7.87 7.49,9.18 C5.2 7.49,9.79 R15.2
N$38
  Top 0.305: R4.1 13.65,4.13 13.31,4.47 R7.2 12.7,5.08 12.19,5.59 U2.8
N$39
  Top 0.305: R6.2 11.41,4.47 | 11.41,4.47 11.75,4.13 R3.1 | 11.41,4.47 11.68,4.75 U2.7
N$41
  Top 0.305: R5.2 9.5,4.47 9.53,4.45 | 9.53,4.45 9.84,4.13 R2.1 | 9.53,4.45 10.48,5.4 10.95,5.4 11.18,5.62 U2.6
N$42  (via drill 0.3)
  Top 0.305: U2.14 11.68,9.94 v11.91,10.16 | Q1.5 v15.88,15.56 15.88,17.14 TP10.1
  Bottom 0.305: v15.88,15.56 11.91,11.59 v11.91,10.16
PP_N3V3_ANALOG  (via drill 0.3)
  Top 0.305: C10.2 12.7,9.68 | 12.7,9.68 v12.86,9.53 | U2.13 12.19,9.18 12.7,9.68 | VR3.1 35.85,27.94 C30.1 | U4.2 7.75,14.61 C15.1 6.96,14.74 v6.83,14.61 | Q1.7 Q1.8 | Q1.8 Q1.1 23.81,11.75 v24.29,12.22 | Q1.8 15.69,11.75 C12.1 | U3.2 32.36,13.65 C14.1 32.38,13.18 v32.07,12.86
  Top 0.406: C30.1 R23.1 35.7,25.4 C24.1 36.01,23.97 C20.1 36.33,22.09 TP15.1
  other vias: 33.66,13.97 33.18,13.49 33.66,13.02 33.18,12.54
  pour Route15: 11.43,8.57 13.65,8.57 13.65,10.64 25.72,10.64 25.72,12.86 30.96,12.86 30.96,12.22 34.29,12.22 34.29,14.29 22.86,14.29 22.86,13.18 11.43,13.18
  pour Route15: 12.06,13.34 12.06,13.97 10.16,13.97 10.16,15.24 6.35,15.24 6.35,13.81 8.26,13.81 8.26,12.54 12.06,12.54
  pour Bottom: 35.56,22.86 38.1,22.86 38.1,20.32 38.1,16.83 33.5,12.22 31.91,12.22 31.43,12.7 31.43,13.18 35.56,17.3
PP_N5V_VIN  (via drill 0.3, 0.5)
  Top 0.305: VR3.8 35.85,32.81 C37.1 | VR3.5 37.77,31.9 v38.26,32.38
  Top 0.406: C37.1 35.38,33 v35.08,32.7
  Bottom 0.305: v38.26,32.38 37.94,32.7 v35.08,32.7
  Bottom 0.61: TP24.1 35.08,38.58 v35.08,32.7
PP_P3V3_ANALOG  (via drill 0.3)
  Top 0.305: U2.5 9.82,6.17 9.18,5.53 C2.1 7.8,5.53 v7.78,5.56 | C9.1 10.16,9.68 | 10.16,9.68 v10,9.53 | U2.16 10.67,9.18 10.16,9.68 | VR1.1 25.7,27.94 C28.1 | R19.1 13.34,15.53 C16.1 13.31,15.55 U4.5 11.59,15.29 v11.59,14.76 | C32.1 10.77,32.25 v10.64,32.38 10.5,32.25 C31.1 8.77,32.25 U5.9 | C27.1 10.77,26.17 v10.64,26.04 10.5,26.17 C26.1 8.77,26.17 U5.8 | C11.1 28.26,11.59 v27.94,11.91 | U3.5 27.94,12.49 v27.94,11.91 | R16.1 27.62,11.59 v27.94,11.91
  Top 0.406: C28.1 R21.1 25.54,25.4 C22.1 25.85,23.97 C18.1 26.17,22.09 TP13.1
  pour Route15 (rank 2): 4.6,3.81 10.16,3.81 10.16,8.41 11.43,8.41 11.43,11.11 39.37,11.11 39.37,17.78 27.94,17.78 27.94,22.86 25.4,22.86 25.4,16.83 4.6,16.83
  pour Route15: 12.7,33.02 8.89,33.02 8.89,21.59 5.08,21.59 5.08,16.51 12.7,16.51
PP_P3V3_DIGITAL  (via drill 0.3, 0.35)
  Top 0.305: U2.12 13.33,8.38 C6.1 14.42,9.03 v14.76,9.37 | U2.9 13.33,6.86 C1.1 14.42,6.21 v14.76,5.87 | R9.1 v20,5.4 | R12.1 v20,9.84 | VR2.1 30.77,27.94 C29.1 | R5.1 v8.89,2.7 | R6.1 v10.79,2.7 | R7.1 v12.7,2.7 | U1.8 28.81,10.18 C8.1 C7.1 25.9,10.18 v25.56,9.84 | U5.3 5.38,25.54 v4.92,25.08 C21.1 C25.1
  Top 0.406: C29.1 R22.1 30.61,25.4 C23.1 30.93,23.97 C19.1 31.25,22.09 TP14.1
  pour Route15 (rank 4): -2.54,44.45 -2.54,-2.54 41.91,-2.54 41.91,44.45
PP_P5V_VIN  (via drill 0.3, 0.5)
  Top 0.305: VR1.8 25.7,32.81 C33.1 | VR2.8 30.77,32.81 C35.1 | VR1.5 27.61,31.9 v28.1,32.38 | VR2.5 33.18,32.33 v33.18,32.38
  Top 0.406: C33.1 25.22,33 v24.92,32.7 | C35.1 30.3,33 v30,32.7
  Bottom 0.305: v28.1,32.38 25.24,32.38 v24.92,32.7 | v33.18,32.38 32.86,32.7 v30,32.7
  Bottom 0.61: v24.92,32.7 24.92,35.08 TP22.1 30,38.58 v30,32.7
T/H_DAC_!LDAC!
  Top 0.305: U5.1 4.08,27.68 1.91,29.84 1.91,36.2 2.54,36.83 TP18.1
T/H_DAC_!SYNC!
  Top 0.305: U5.2 4.72,28.3 2.7,30.32 2.7,35.08 5.08,37.47 TP19.1
T/H_DAC_DIN
  Top 0.305: U5.15 4.72,33.3 6.35,34.92 7.62,34.92 10.16,37.47 TP21.1
T/H_DAC_SCLK
  Top 0.305: U5.16 4.08,33.92 7.62,37.47 TP20.1

### Text on the board
tPlace: TCSPC / Frontend Prototype | jackmaxg@mit.edu / Jackson Gray